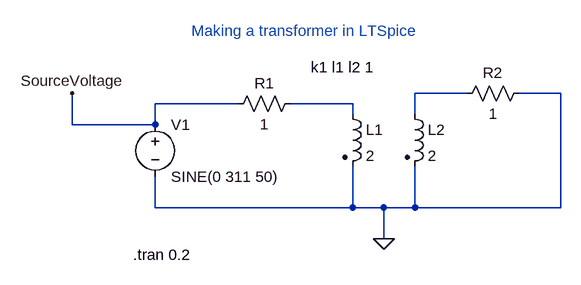
[diagram p0: schematic SampleTransformer.asc]
SampleTransformer.asc, the LTspice schematic file:
Version 4
SHEET 1 880 680
WIRE 464 112 384 112
WIRE 608 112 544 112
WIRE 112 128 -16 128
WIRE 288 128 192 128
WIRE 288 144 288 128
WIRE 384 144 384 112
WIRE -144 160 -144 112
WIRE -16 160 -16 128
WIRE -16 160 -144 160
WIRE -16 288 -16 240
WIRE 288 288 288 224
WIRE 288 288 -16 288
WIRE 336 288 288 288
WIRE 384 288 384 224
WIRE 384 288 336 288
WIRE 608 288 608 112
WIRE 608 288 384 288
WIRE 336 336 336 288
FLAG 336 336 0
FLAG -144 112 SourceVoltage
SYMBOL voltage -16 144 R0
WINDOW 123 0 0 Left 0
WINDOW 39 0 0 Left 0
SYMATTR InstName V1
SYMATTR Value SINE(0 311 50)
SYMBOL ind2 272 128 R0
SYMATTR InstName L1
SYMATTR Value 2
SYMATTR Type ind
SYMBOL res 208 112 R90
WINDOW 0 0 56 VBottom 2
WINDOW 3 32 56 VTop 2
SYMATTR InstName R1
SYMATTR Value 1
SYMATTR SpiceLine tol=1 pwr=0.1
SYMBOL ind2 368 128 R0
SYMATTR InstName L2
SYMATTR Value 2
SYMATTR Type ind
SYMBOL res 560 96 R90
WINDOW 0 0 56 VBottom 2
WINDOW 3 32 56 VTop 2
SYMATTR InstName R2
SYMATTR Value 1
SYMATTR SpiceLine tol=1 pwr=0.1
TEXT 40 16 Left 2 ;Making a transformer in LTSpice
TEXT 224 72 Left 2 !k1 l1 l2 1
TEXT -50 360 Left 2 !.tran 0.2

The netlist it stands for:
* SampleTransformer.asc
V1 SourceVoltage 0 SINE(0 311 50)
L1 N002 0 2
R1 N002 SourceVoltage 1 tol=1 pwr=0.1
L2 N001 0 2
R2 0 N001 1 tol=1 pwr=0.1
* Making a transformer in LTSpice
k1 l1 l2 1
.tran 0.2
.backanno
.end